# Altium schematic sheet power_supplies.SchDoc
size A4; SheetNumber: 4; SheetTotal: 10
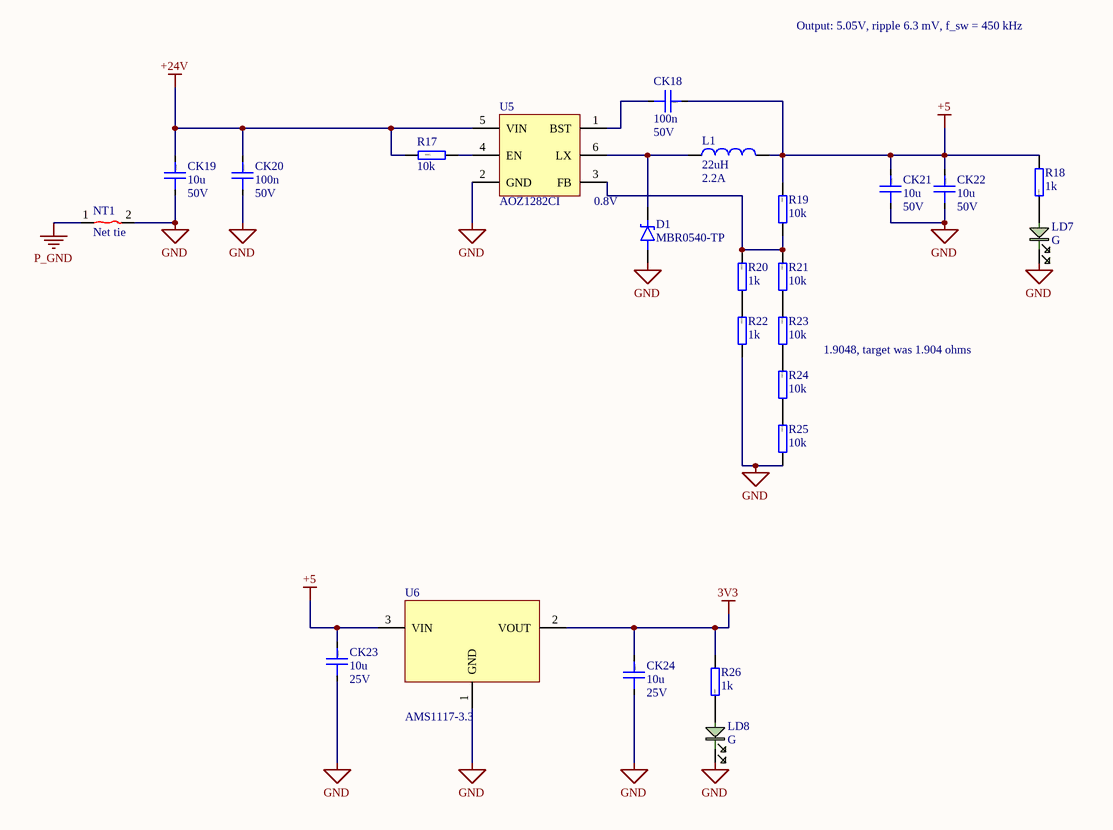
[diagram p0: power_supplies.SchDoc]

## Parts
CK18  100n  Voltage rating: 50V  [CAP0603]
CK19  10u  Voltage rating: 50V  [CAP1206]
CK20  100n  Voltage rating: 50V  [CAP0603]
CK21  10u  Voltage rating: 50V  [CAP1206]
CK22  10u  Voltage rating: 50V  [CAP1206]
CK23  10u  Voltage rating: 25V  [CAP0805]
CK24  10u  Voltage rating: 25V  [CAP0805]
D1  MBR0540-TP  [SOD3716X135N]
L1  22uH  Current: 2.2A  [ETQP3M_KVN]
LD7  G  [0603_LED_G]
LD8  G  [0603_LED_G]
NT1  Net tie  [Net tie]  (net tie, no BOM)
R17  10k  [RESC2012X06N(SMR0805)]
R18  1k  [RESC2012X06N(SMR0805)]
R19  10k  [RESC2012X06N(SMR0805)]
R20  1k  [RESC2012X06N(SMR0805)]
R21  10k  [RESC2012X06N(SMR0805)]
R22  1k  [RESC2012X06N(SMR0805)]
R23  10k  [RESC2012X06N(SMR0805)]
R24  10k  [RESC2012X06N(SMR0805)]
R25  10k  [RESC2012X06N(SMR0805)]
R26  1k  [RESC2012X06N(SMR0805)]
U5  AOZ1282CI  [SOT23-6]
U6  AMS1117-3.3  [SOT230P700X180-4M]

## Nets
3V3: CK24.1 R26.1 U6.2(VOUT)
+5: CK18.1 CK21.1 CK22.1 CK23.1 L1.2 R18.1 R19.2 U6.3(VIN)
+24V: CK19.1 CK20.1 R17.2 U5.5(VIN)
GND: CK19.2 CK20.2 CK21.2 CK22.2 CK23.2 CK24.2 D1.2(A) LD7.2 LD8.2 NT1.2 R22.1 R25.1 U5.2(GND) U6.1(GND)
P_GND: NT1.1
NetCK18_2: CK18.2 U5.1(BST)
NetD1_1: D1.1(K) L1.1 U5.6(LX)
NetLD7_1: LD7.1 R18.2
NetLD8_1: LD8.1 R26.2
NetR17_1: R17.1 U5.4(EN)
NetR19_1: R19.1 R20.2 R21.2 U5.3(FB)
NetR20_1: R20.1 R22.2
NetR21_1: R21.1 R23.2
NetR23_1: R23.1 R24.2
NetR24_1: R24.1 R25.2

## Notes on the sheet
- Output: 5.05V, ripple 6.3 mV, f_sw = 450 kHz
- 0.8V
- 1.9048, target was 1.904 ohms
- (in symbol Cap 10u 50V 1206) 1206
- (in symbol Cap 10u 0805) 0805
- (in symbol Cap 100n 50V 0603) 0603

## Library data of the parts
CK18 CK20 = Cap 100n 50V 0603: 50V 100nF X7R ±10% 0603 Multilayer Ceramic Capacitors MLCC - SMD/SMT ROHS; Basic: Yes; Value: 100n; JLCPCB Part: C14663
CK19 CK21 CK22 = Cap 10u 50V 1206: 50V 10uF X5R ±10% 1206 Multilayer Ceramic Capacitors MLCC - SMD/SMT ROHS; Basic: Yes; JLCPCB Part: C13585; Value: 10u
CK23 CK24 = Cap 10u 0805: 25V 10uF X5R ±10% 0805 Multilayer Ceramic Capacitors MLCC - SMD/SMT ROHS; Basic: Yes; JLCPCB Part: C15850; Value: 10u
D1 = Diode Schottky MBR0540-TP: Diode 40 V 500mA Surface Mount SOD-123; Manufacturer_Name: MCC; Basic: No; Datasheet Link: https://mccsemi.com/pdf/Products/MBR0520-MBR0580(SOD123).pdf; Height: 1.35mm; Manufacturer_Part_Number: MBR0540-TP; Mouser Part Number: 833-MBR0540-TP; Mouser Price/Stock: https://www.mouser.co.uk/ProductDetail/Micro-Commercial-Components-MCC/MBR0540-TP?qs=Vo7e0yZOYdEH3ZK7VsaoCA%3D%3D; Arrow Part Number: MBR0540-TP; Arrow Price/Stock: https://www.arrow.com/en/products/mbr0540-tp/micro-commercial-components?region=nac; JLCPCB Part: C78744; TME Part: MBR0540-TP
L1 = Ind 22uH 2.2A: 2.2A 22uH Integrated molded inductor ±20% SMD,6.4x6mm Power Inductors ROHS; Basic: No; Published: 1-Apr-2025; Publisher: Altium Limited; Value: 22uH; JLCPCB Part: C412305; TME Part: ETQP3M220KVN
LD7 LD8 = LED G 0603: 0603 Green Led; JLCPCB Part: C22371297
R17 R19 R21 R23-R25 = Res 10k 0805: 125mW Thick Film Resistors 150V ±100ppm/℃ ±1% 10kΩ 0805 Chip Resistor - Surface Mount ROHS; Tolerance & Rating: 1%/0.1W; Basic: Yes; Value: 10k; Package: 0805; SMD: 1; ComponentLink3Description: rezistor čip; ComponentLink3URL: heliosgreen://v1/hegMT/5-MT/Classes(343)/Folders/OpenForm?RecordNumbers=[381513]; JLCPCB Part: C17414
R18 R20 R22 R26 = Res 1k 0805: 125mW Thick Film Resistors 150V ±100ppm/℃ ±1% 1kΩ 0805 Chip Resistor - Surface Mount ROHS; Tolerance & Rating: 1%/0.1W; Basic: Yes; Value: 1k; Package: 0805; Author: JP/27.03.2014; SMD: 1; ComponentLink3Description: rezistor čip; ComponentLink3URL: heliosgreen://v1/hegMT/5-MT/Classes(343)/Folders/OpenForm?RecordNumbers=[381513]; JLCPCB Part: C17513
U5 = AOZ1282CI: Step-down type Adjustable 800mV~36V 1.2A 4.5V~36V SOT-23-6 DC-DC Converters ROHS; Manufacturer_Name: Alpha & Omega Semiconductors; Basic: No; Datasheet Link: http://www.aosmd.com/res/data_sheets/AOZ1282CI.pdf; Height: 1.25mm; Manufacturer_Part_Number: AOZ1282CI; Arrow Part Number: AOZ1282CI; Arrow Price/Stock: https://www.arrow.com/en/products/aoz1282ci/alpha-and-omega-semiconductor?region=nac; JLCPCB Part: C111916; TME Part: AOZ1282CI
U6 = AMS1117-3.3: 72dB@(120Hz) 1A Fixed 3.3V Positive electrode SOT-223 Voltage Regulators - Linear, Low Drop Out (LDO) Regulators ROHS; Basic: Yes; JLCPCB Part: C6186